# EAGLE design LB_BIT_o1_LED-v02(rev1) (EAGLE 6.1)

## Sheet 1 of 2
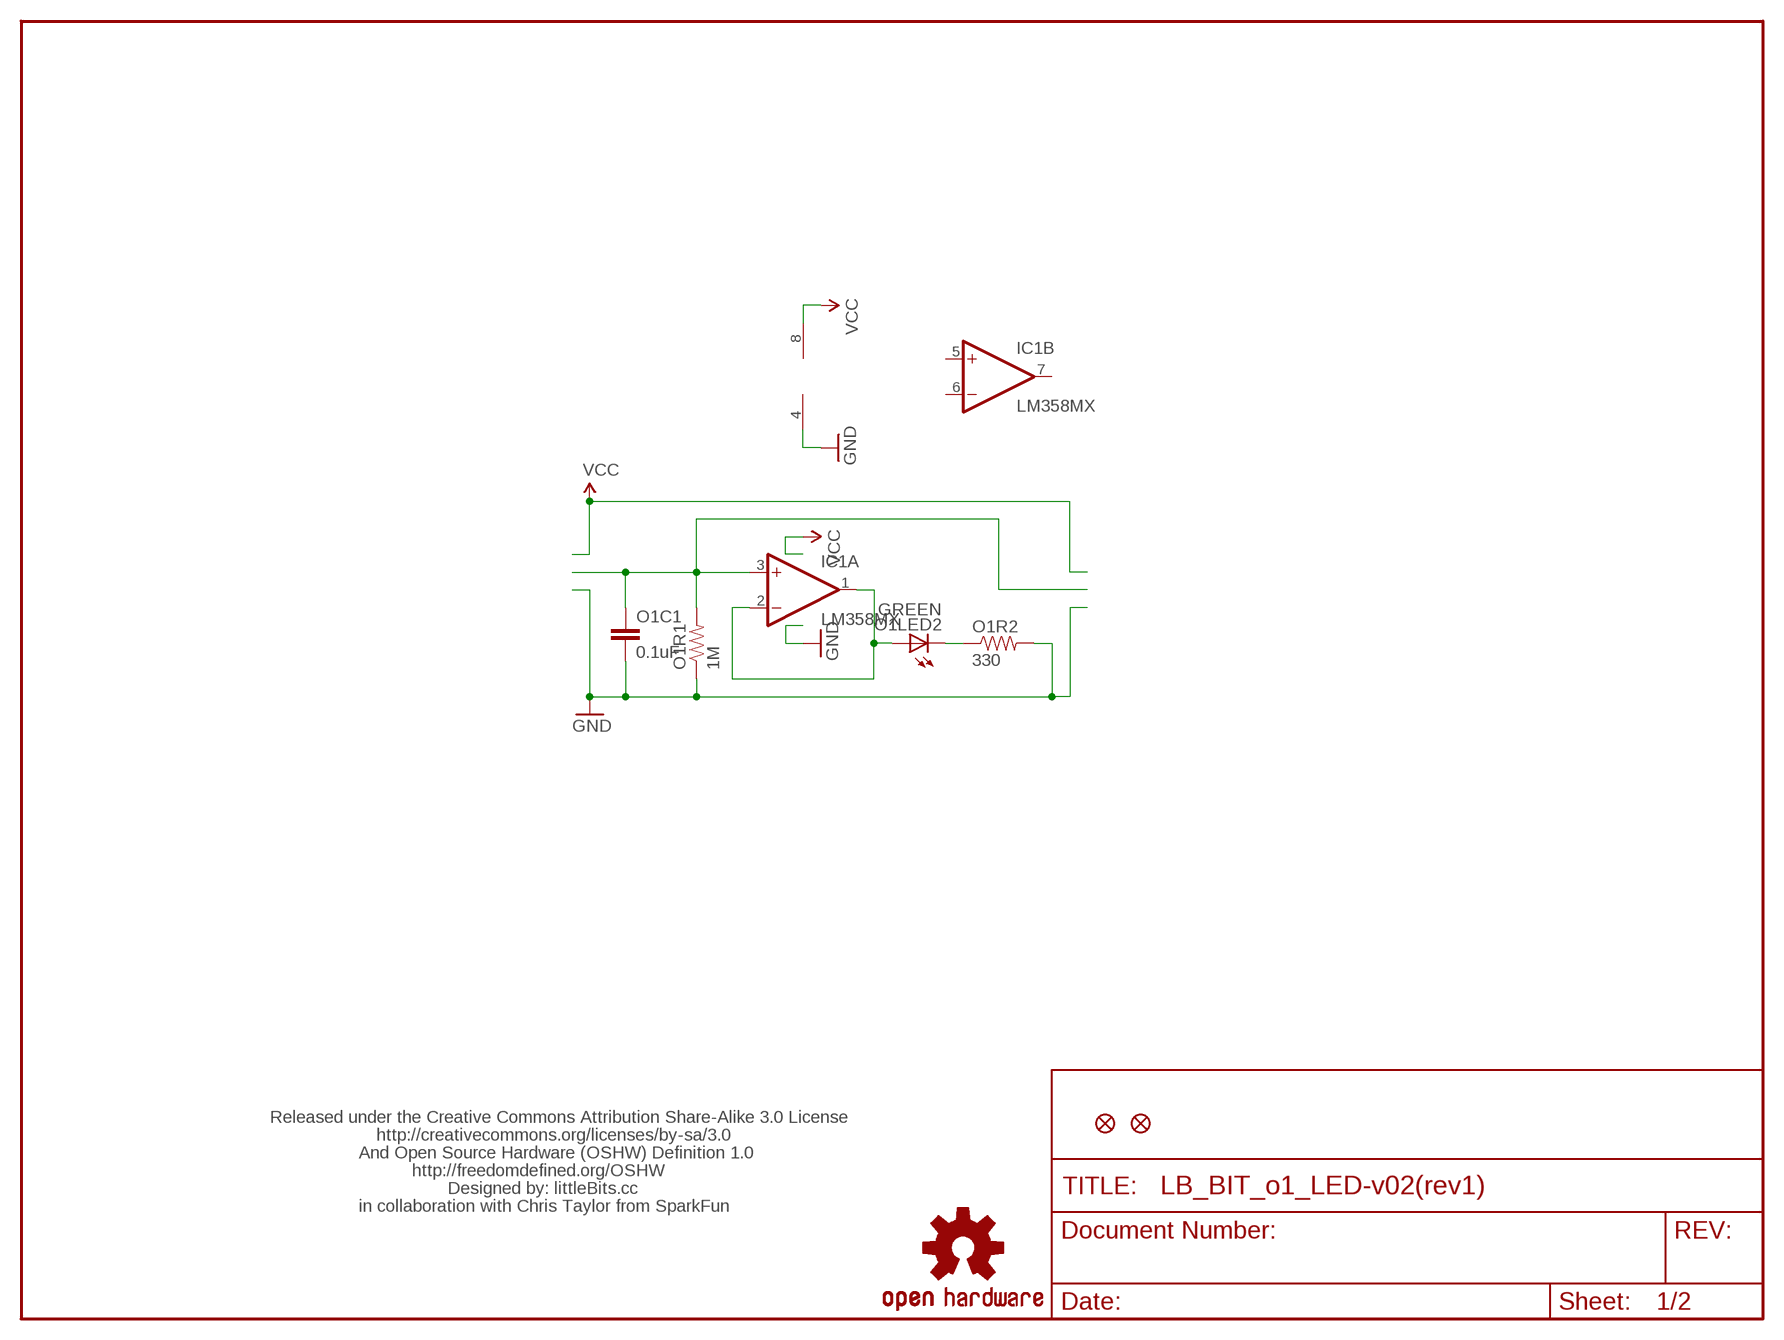
[diagram p0: schematic, sheet 1]

### Parts
IC1  LM358MX  [SO08]
JP1  FIDUCIAL1X2.5  [FIDUCIAL-1X2.5]
JP2  FIDUCIAL1X2.5  [FIDUCIAL-1X2.5]
O1C1  0.1uF  CAP1206  [1206]
O1LED2  GREEN  LED1206  [LED-1206]
O1R1  1M  RESISTOR  [0805]
O1R2  330  RESISTOR  [0805]
U$1  LB_CREDITS  [OSHWCREDIT]
U$3  OSHW-LOGOL  [OSHW-LOGO-L]

### Nets
GND: IC1.4(P:V-) O1C1.2 O1R1.1 O1R2.2 ; also sheet 2
LEDGND: O1LED2.C O1R2.1
N$1: IC1.1(A:OUT) IC1.2(A:-IN) O1LED2.A
SIG: IC1.3(A:+IN) O1C1.1 O1R1.2 ; also sheet 2
VCC: IC1.8(P:V+) ; also sheet 2
Unconnected: IC1.5(B:+IN) IC1.6(B:-IN) IC1.7(B:OUT)

## Sheet 2 of 2
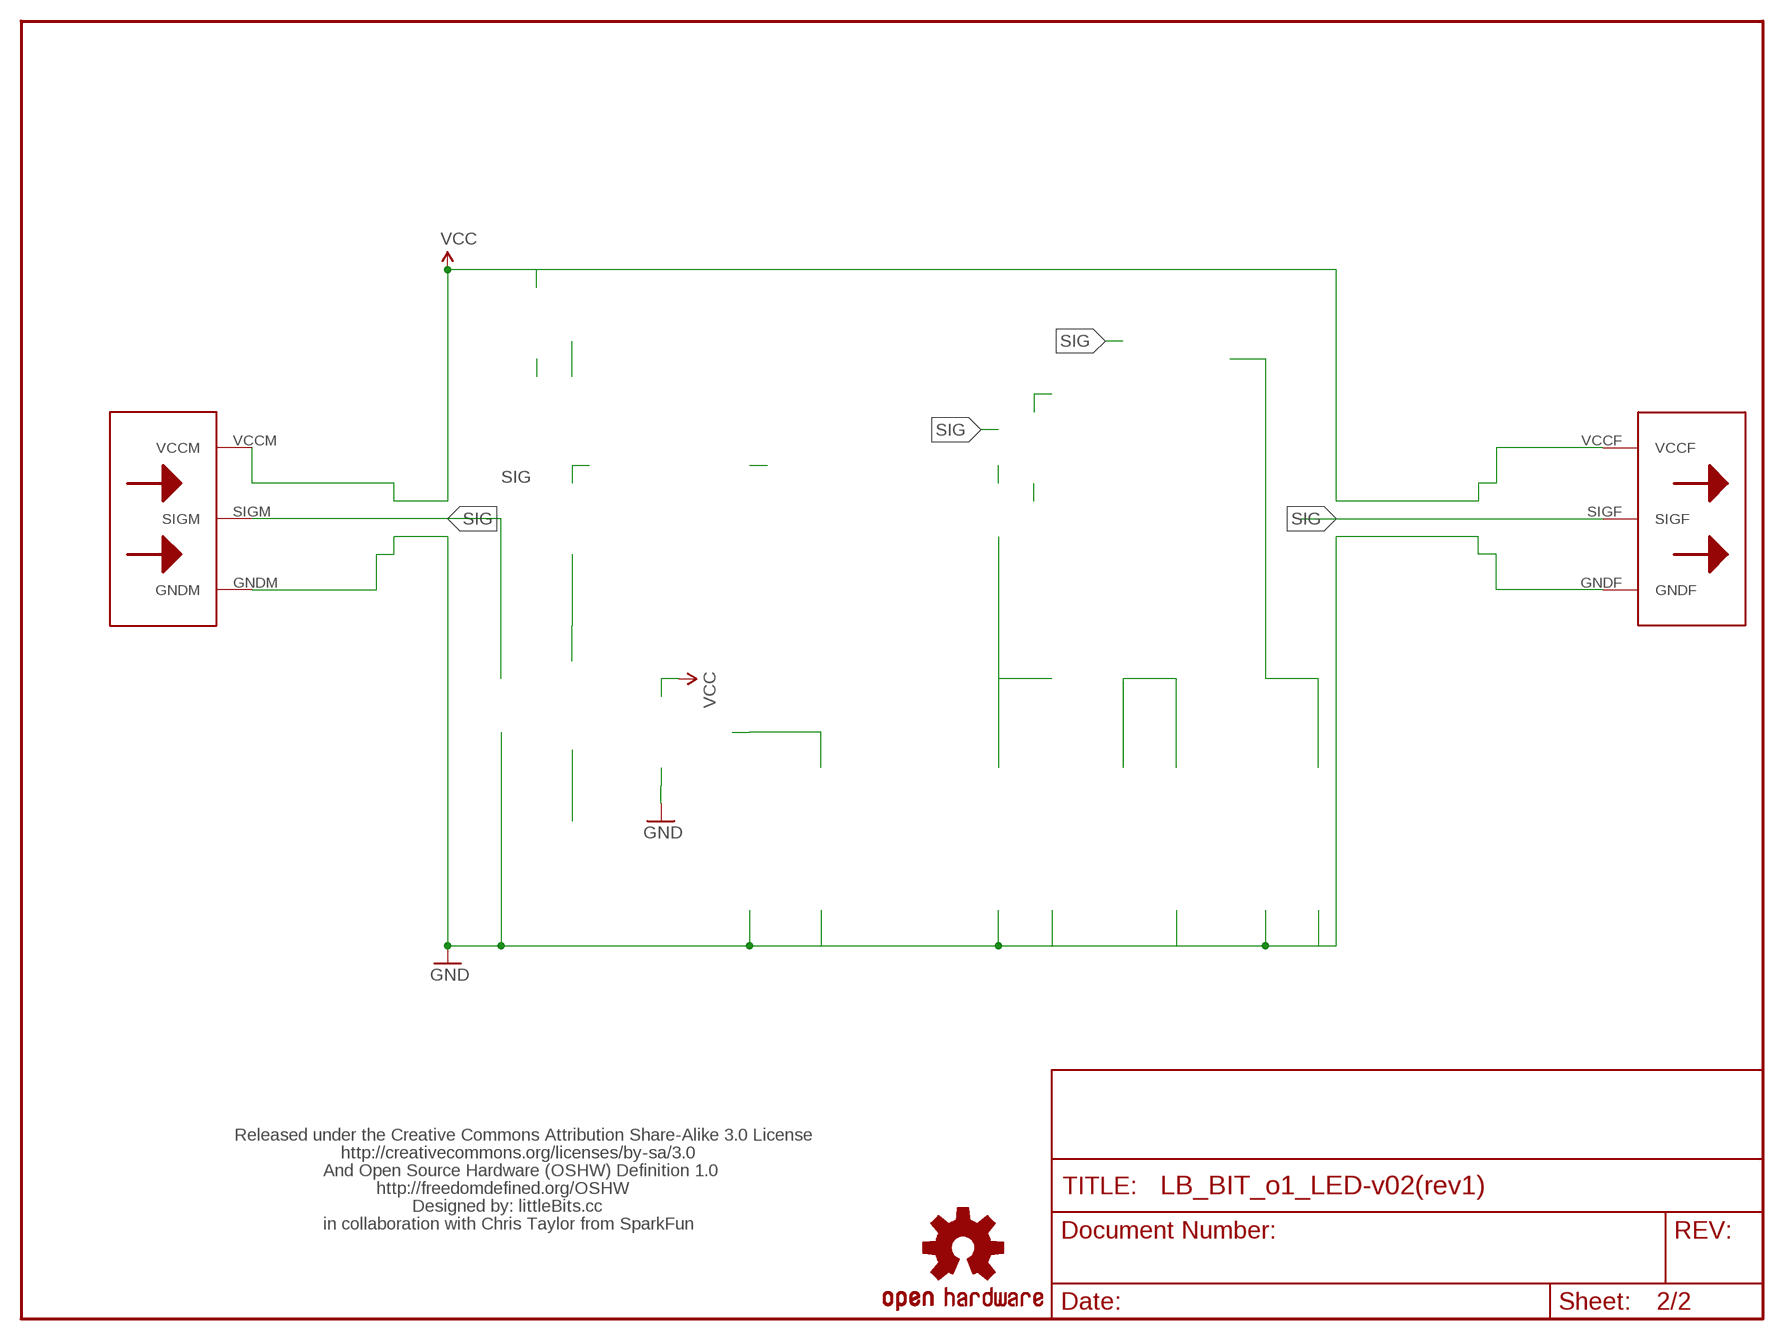
[diagram p1: schematic, sheet 2]

### Parts
U$2  OSHW-LOGOL  [OSHW-LOGO-L]
U$4  LB_CREDITS  [OSHWCREDIT]
U$8  BIGBIT  [BIGBIT]

### Nets
GND: U$8.GNDF U$8.GNDM ; also sheet 1
SIG: U$8.SIGF U$8.SIGM ; also sheet 1
VCC: U$8.VCCF U$8.VCCM ; also sheet 1

## Library data of the parts
IC1 = linear:LM358: OP AMP also LM158; LM258; LM2904 Source: http://cache.national.com/ds/LM/LM158.pdf
JP1 JP2 = abes:FIDUCIAL: Fiducial Alignment Points Various fiducial points for machine vision alignment.
O1C1 = SparkFun:CAP: Capacitor Standard 0603 ceramic capacitor, and 0.1" leaded capacitor.
O1LED2 = SparkFun:LED: LEDs Standard schematic elements and footprints for 5mm, 3mm, 1206, and 0603 sized LEDs. 5mm - Spark Fun Electronics SKU : COM-00529 (and others)
O1R1 O1R2 = SparkFun:RESISTOR: Resistor Basic schematic elements and footprints for 0603, 1206, and PTH 1/10th watt (small) resistors.
U$1 U$4 = LITTLEBITS:LB_CREDITS
U$2 U$3 = SparkFun:OSHW-LOGO: Open Source Hardware Logo This logo indicates the piece of hardware it is found on incorporates a OSHW license and/or adheres to the definition of open source hardware found here: http://freedomdefined.org/OSHW
U$8 = bigbits:BIGBIT: BigBit completo Male entra o Sinal Female sai o Sinal Esquerda --> Direita

## Board
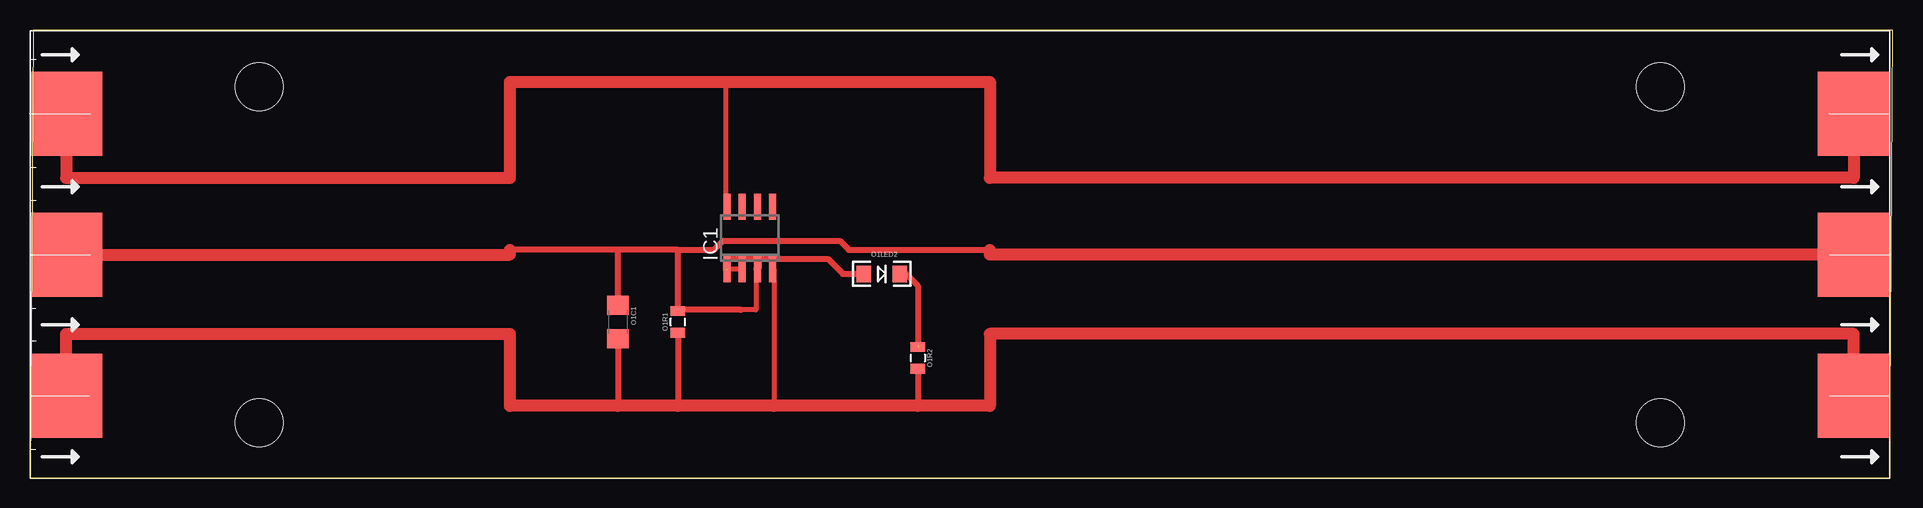
[diagram p2: board, top side]

Size 155.29 x 37.33 mm. Coordinates in mm from the lower left corner, seen from the top.
Outline: 0,0 155.04,0 155.29,37.33 0.25,37.33 0,0
Copper layers (1*16): Top 0.035mm / dielectric 1.5mm / Bottom 0.035mm
Design rules: minimum track width 10mil, minimum drill 24mil, track to track 8mil, track to pad 8mil, pad to pad 8mil, via to via 8mil, smd to smd 8mil, copper to edge 40mil, drill to drill 8mil, minimum pad ring 10mil, minimum via ring 8mil, stop-mask expansion 4mil, vias tented up to drill 0mil, thermal gap 10mil

### Footprints (pad centres in the part's own frame; a part is rotated, then mirrored left to right if it is on the bottom)
SO08 = smd 0.6 x 2.2: 1 -1.905,-2.6; 2 -0.635,-2.6; 3 0.635,-2.6; 4 1.905,-2.6; 5 1.905,2.6; 6 0.635,2.6; 7 -0.635,2.6; 8 -1.905,2.6
FIDUCIAL-1X2.5 = smd 0.635 x 0.635: 1 0,0
1206 = smd 1.6 x 1.8: 1 -1.4,0; 2 1.4,0
LED-1206 = smd 1.2 x 1.4: A -1.5,0; C 1.5,0
0805 = smd 0.8 x 1.2: 1 -0.9,0; 2 0.9,0
BIGBIT = smd 6 x 7: GNDF 152,-30.38; GNDM 3,-30.38; SIGF 152,-18.64; SIGM 3,-18.64; VCCF 152,-6.89; VCCM 3,-6.89 | hole 4: 135.9,-4.64; 135.9,-32.639; 19.1,-4.64; 19.1,-32.639

### Placement (x,y rotation side)
IC1  60,20 0 top
JP1  -40.64,19.05 0 top  (outside the outline)
JP2  -43.18,19.05 0 top  (outside the outline)
O1C1  49,13 270 top
O1LED2  71,17 0 top
O1R1  54,13 90 top
O1R2  74,10 270 top
U$1  -48.26,1.27 0 top  (outside the outline)
U$2  -31.75,30.48 0 top  (outside the outline)
U$3  -16.51,20.32 0 top  (outside the outline)
U$4  -48.26,1.27 0 top  (outside the outline)
U$8  0,37.25 0 top

### Tracks (layer width: path | path; a pad name or v marks a point on that pad's centre or on a via)
GND
  Top 0.406: IC1.4 62,17.4 62,6
  Top 0.5: O1C1.2 49,6 | O1R1.1 54,6 | O1R2.2 74,6
  Top 1: U$8.GNDM 3,12 40,12 40,6 49,6 54,6 62,6 74,6 80,6 80,12 152,12 U$8.GNDF
LEDGND  (1 unrouted)
  Top 0.5: O1LED2.C 73,17 74,16 74,11
N$1  (1 unrouted)
  Top 0.406: IC1.2 IC1.1
  Top 0.5: 58,17.38 58,18 58.25,18.25 60.75,18.25 | 60.75,17.5 60.75,18.25 | 60.75,18.25 66.5,18.25 67.75,17 O1LED2.A
SIG
  Top 0.406: IC1.3 60.5,17.4 60.5,14 59.25,14
  Top 0.5: O1C1.1 49,19 | 49,19 40,19 | O1R1.2 54,14 | 54,14 54,19 | 54,19 49,19 | 54,19 57,19 57.75,19.75 67.5,19.75 68.25,19 80,19 | 59.25,14 54,14
  Top 1: U$8.SIGM 40,18.61 40,19 | U$8.SIGF 80,18.61 80,19
VCC
  Top 0.406: IC1.8 58,22.6 58,33
  Top 1: U$8.VCCM 3,25 40,25 40,33 58,33 80,33 80,25 152,25 U$8.VCCF